# Altium schematic sheet AccumulatorHV2 (1).SchDoc
size 762 x 317 mm
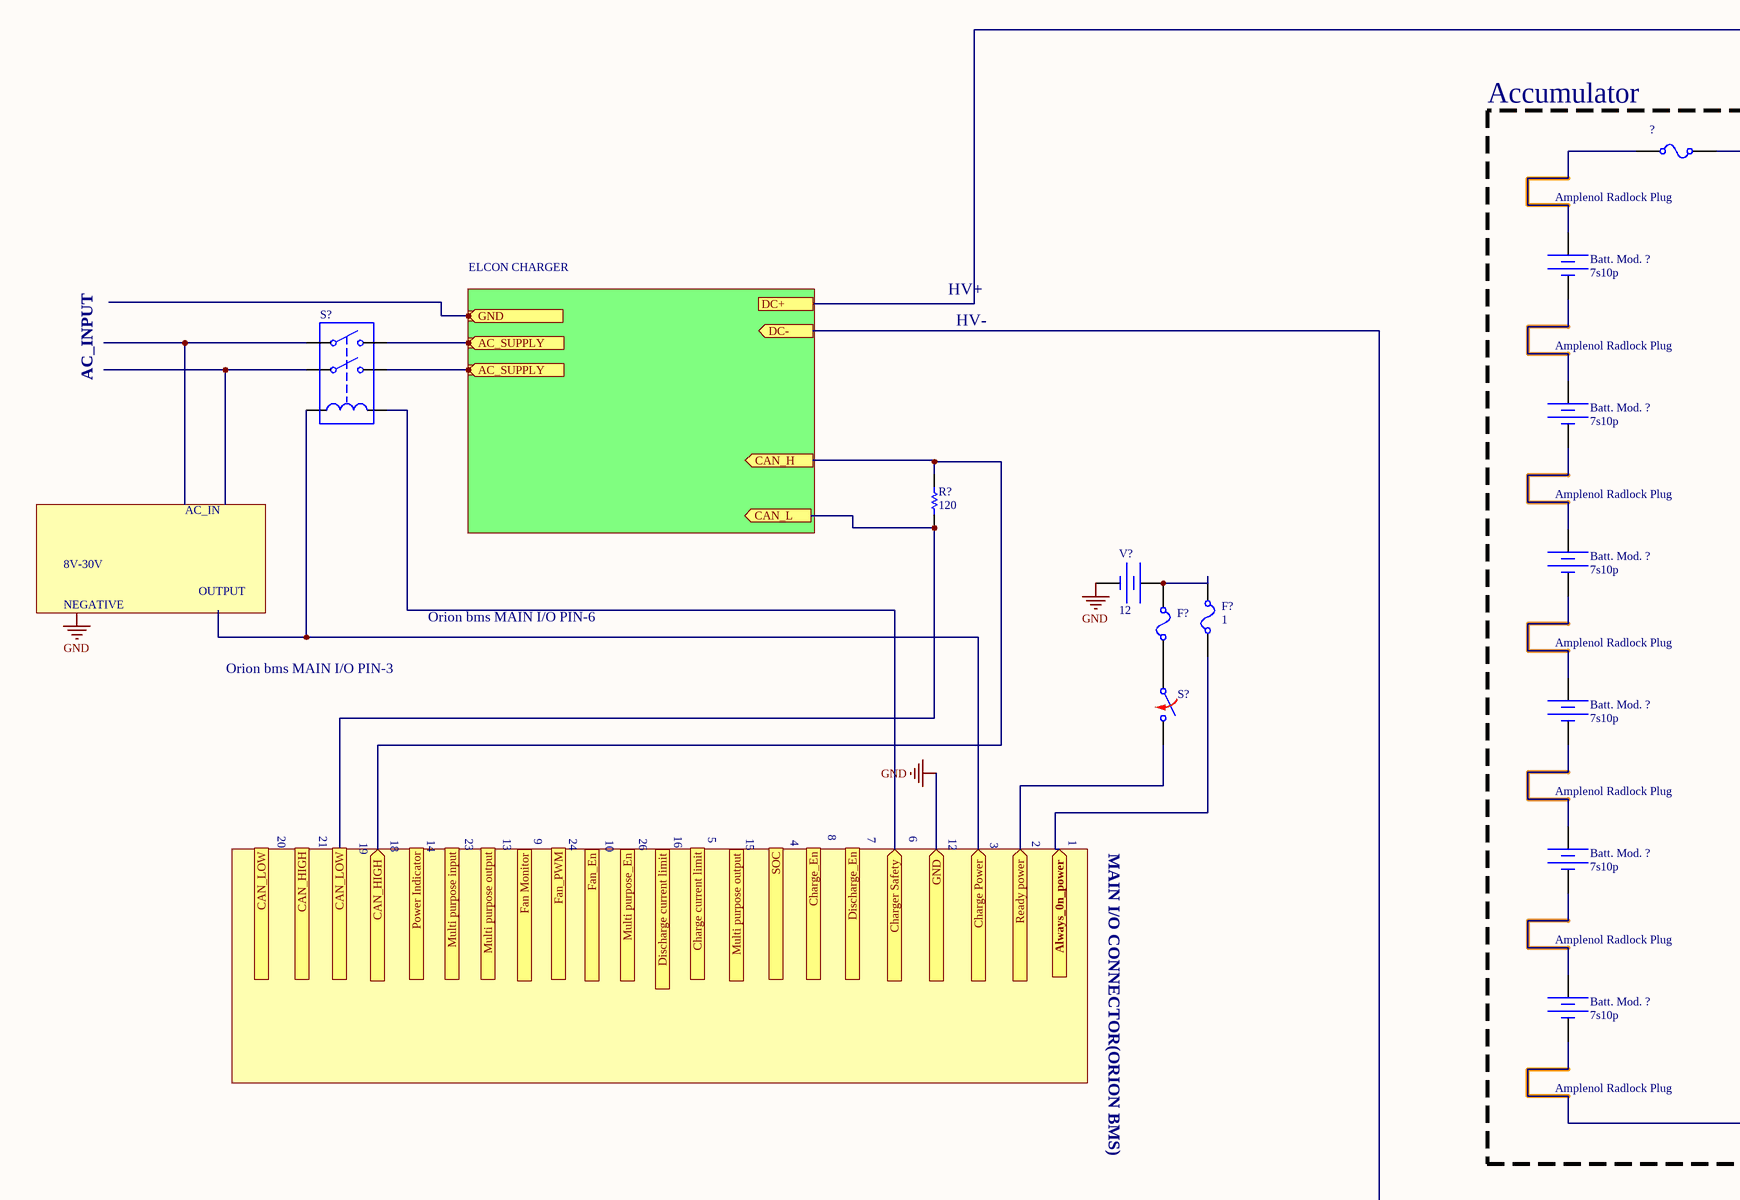
[diagram p0: AccumulatorHV2 (1).SchDoc, left]
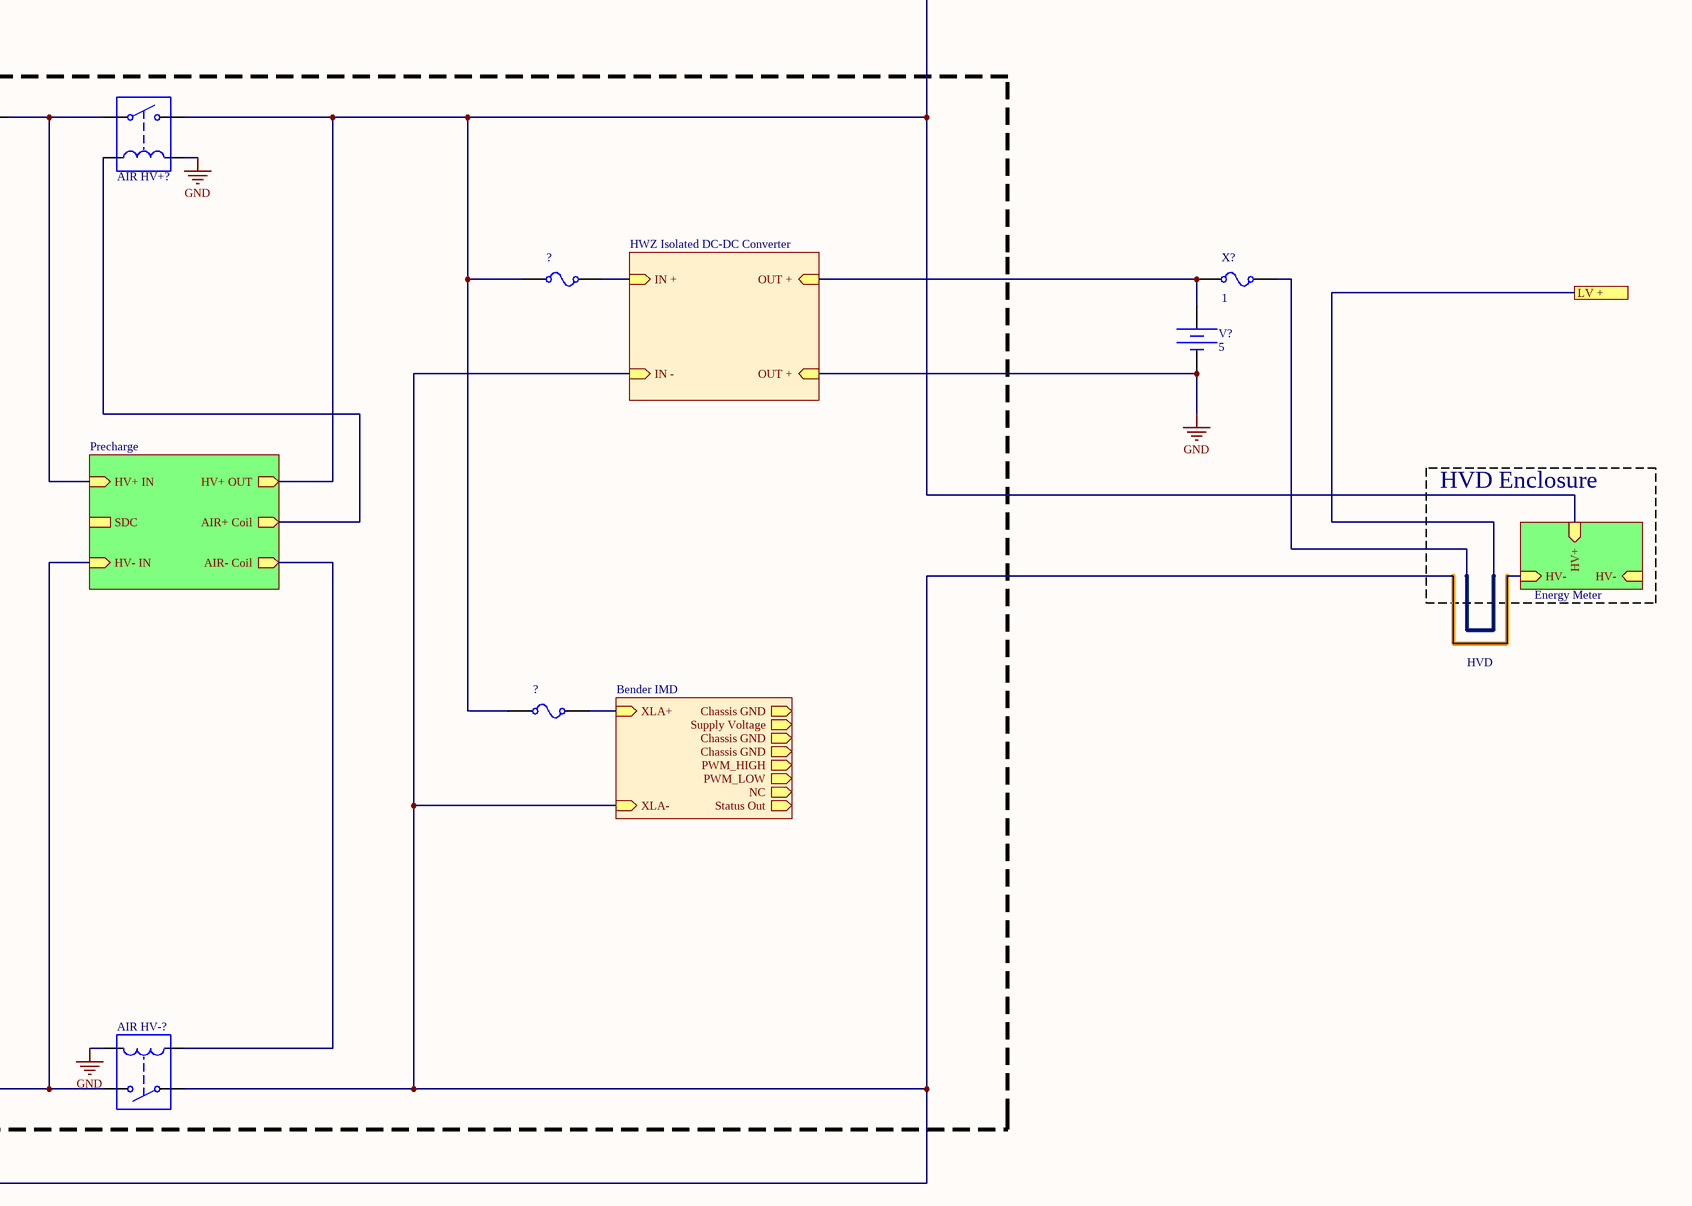
[diagram p1: AccumulatorHV2 (1).SchDoc, right]

## Parts
(Parts that share a designator on the sheet are numbered #1, #2 ... from top to bottom, then left to right.)
?#1  Fuse  (value not drawn)
?#2  Fuse  (value not drawn)
?#3  Fuse  (value not drawn)
AIR_HV+?  Single-Pole, Single-Throw Normally Opened Relay  (value not drawn)
AIR_HV-?  Single-Pole, Single-Throw Normally Opened Relay  (value not drawn)
Batt._Mod._?#1  DC Magnitude: 7s10p  (hidden comment: Constant Voltage Source)
Batt._Mod._?#2  DC Magnitude: 7s10p  (hidden comment: Constant Voltage Source)
Batt._Mod._?#3  DC Magnitude: 7s10p  (hidden comment: Constant Voltage Source)
Batt._Mod._?#4  DC Magnitude: 7s10p  (hidden comment: Constant Voltage Source)
Batt._Mod._?#5  DC Magnitude: 7s10p  (hidden comment: Constant Voltage Source)
Batt._Mod._?#6  DC Magnitude: 7s10p  (hidden comment: Constant Voltage Source)
F?#1  CURRENT: 1  (hidden comment: Fuse)
F?#2  Fuse  (value not drawn)
R?  value 120
S?#1  Double-Pole, Single-Throw Relay  (value not drawn)
S?#2  Switch Normally Opened  (value not drawn)
V?#1  DC Magnitude: 5  (hidden comment: Constant Voltage Source)
V?#2  DC Magnitude: 12  (hidden comment: Constant Voltage Source)
X?  CURRENT: 1  (hidden comment: Fuse)

## Blocks framed on the sheet
Accumulator: ?#1-?#3 AIR_HV+? AIR_HV-? Batt._Mod._?#1-Batt._Mod._?#6

## Sub-sheets
Bender IMD = ?: XLA+ (in), XLA- (in), Supply Voltage (out), Chassis GND (out), PWM_LOW (out), NC (out), PWM_HIGH (out), Chassis GND (out), Chassis GND (out), Status Out (out)
ELCON CHARGER = F: AC_SUPPLY (in), AC_SUPPLY (in), GND (in), DC+ (out)
Energy Meter = ?: HV- (in), HV- (in), HV+ (in)
HWZ Isolated DC-DC Converter = ?: IN + (in), IN - (in), OUT + (in), OUT + (in)
Precharge = ?: HV+ IN (in), HV+ OUT (out), HV- IN (in), AIR- Coil (out), AIR+ Coil (out), SDC

## Ports
AC_SUPPLY (in), Always_0n_power (in), CAN_H (out), CAN_HIGH (in), CAN_L (out), CAN_LOW, Charge current limit (in), Charge Power (in), Charge_En (in), Charger Safety (in), DC+ (out), DC- (out), Discharge current limit (in), Discharge_En (in), Fan Monitor (in), Fan_En (in), Fan_PWM (in), GND (in), LV +, Multi purpose input, Multi purpose output (in), Multi purpose_En (in), Power Indicator (in), Ready power (in), SOC (in)

## Nets
GND: AIR_HV+?.4 AIR_HV-?.4 V?#1.2 V?#2.2 ; port GND, sheet HWZ Isolated DC-DC Converter/OUT +, sheet ELCON CHARGER/GND
AC_SUPPLY: S?#1.2 S?#1.4 ; port AC_SUPPLY, sheet ELCON CHARGER/AC_SUPPLY, sheet ELCON CHARGER/AC_SUPPLY
Always_0n_power: F?#1.2 ; port Always_0n_power
CAN_H: R?.2 ; port CAN_H, port CAN_HIGH
CAN_L: R?.1 ; port CAN_L, port CAN_LOW
Charge Power: S?#1.5 ; port Charge Power
Charger Safety: S?#1.6 ; port Charger Safety
DC-: AIR_HV-?.1 ; port DC-, sheet Energy Meter/HV-, sheet HWZ Isolated DC-DC Converter/IN -, sheet Bender IMD/XLA-
LV +: X?.2 ; port LV +
Ready power: S?#2.2 ; port Ready power
Net?#1_1: ?#1.1 Batt._Mod._?#1.1
Net?#1_2: ?#1.2 AIR_HV+?.1 ; sheet Precharge/HV+ IN
Net?#2_1: ?#2.1 ?#3.1 AIR_HV+?.2 ; sheet Energy Meter/HV+, sheet Precharge/HV+ OUT, sheet ELCON CHARGER/DC+
Net?#2_2: ?#2.2 ; sheet HWZ Isolated DC-DC Converter/IN +
Net?#3_2: ?#3.2 ; sheet Bender IMD/XLA+
NetAIR_HV+?_3: AIR_HV+?.3 ; sheet Precharge/AIR+ Coil
NetAIR_HV-?_2: AIR_HV-?.2 Batt._Mod._?#6.2 ; sheet Precharge/HV- IN
NetAIR_HV-?_3: AIR_HV-?.3 ; sheet Precharge/AIR- Coil
NetBatt._Mod._?#1_2: Batt._Mod._?#1.2 Batt._Mod._?#2.1
NetBatt._Mod._?#2_2: Batt._Mod._?#2.2 Batt._Mod._?#3.1
NetBatt._Mod._?#3_2: Batt._Mod._?#3.2 Batt._Mod._?#4.1
NetBatt._Mod._?#4_2: Batt._Mod._?#4.2 Batt._Mod._?#5.1
NetBatt._Mod._?#5_2: Batt._Mod._?#5.2 Batt._Mod._?#6.1
NetF?#1_1: F?#1.1 F?#2.1 V?#2.1
NetF?#2_2: F?#2.2 S?#2.1
NetV?#1_1: V?#1.1 X?.1 ; sheet HWZ Isolated DC-DC Converter/OUT +

Not connected (* = marked no-connect by the designer): S?#1 1 3

## Notes on the sheet
- Amplenol Radlock Plug
- HV+
- HV-
- (near Batt._Mod._?#2) Amplenol Radlock Plug
- AC_INPUT
- AC_IN
- (near Batt._Mod._?#3) Amplenol Radlock Plug
- HVD Enclosure
- 8V-30V
- NEGATIVE
- OUTPUT
- Orion bms MAIN I/O PIN-6
- Orion bms MAIN I/O PIN-3
- (near Batt._Mod._?#4) Amplenol Radlock Plug
- HVD
- (near Batt._Mod._?#5) Amplenol Radlock Plug
- 20
- 21
- 19
- 18
- 14
- 23
- 13
- 9
- 24
- 10
- 26
- 16
- 5
- 15
- 4
- 8
- 7
- 6
- 12
- 3
- 2
- 1
- MAIN I/O CONNECTOR(ORION BMS)
- (near Batt._Mod._?#6) Amplenol Radlock Plug
- Labels drawn without touching a wire or pin: GND

## Library data of the parts
?#1-?#3 F?#1 F?#2 X? = Fuse: RESISTANCE: 1m; SimulationGenericComponent: True
AIR_HV+? AIR_HV-? = SPST Relay NO: L_C: 1u; R_C: 100; RON: 1; ROFF: 1e12; ION: 1m; IOFF: 0; SimulationGenericComponent: True
Batt._Mod._?#1-Batt._Mod._?#6 V?#1 V?#2 = Battery: SimulationGenericComponent: True
R? = Resistor: TC1: 0; SimulationGenericComponent: True; TC2: 0
S?#1 = DPST Relay: L_C: 1u; R_C: 100; RON: 1; ROFF: 1e12; ION: 1m; IOFF: 0; SimulationGenericComponent: True
S?#2 = SW NO: closed: 0; Rclosed: 1m; Ropen: 1Meg; SimulationGenericComponent: True